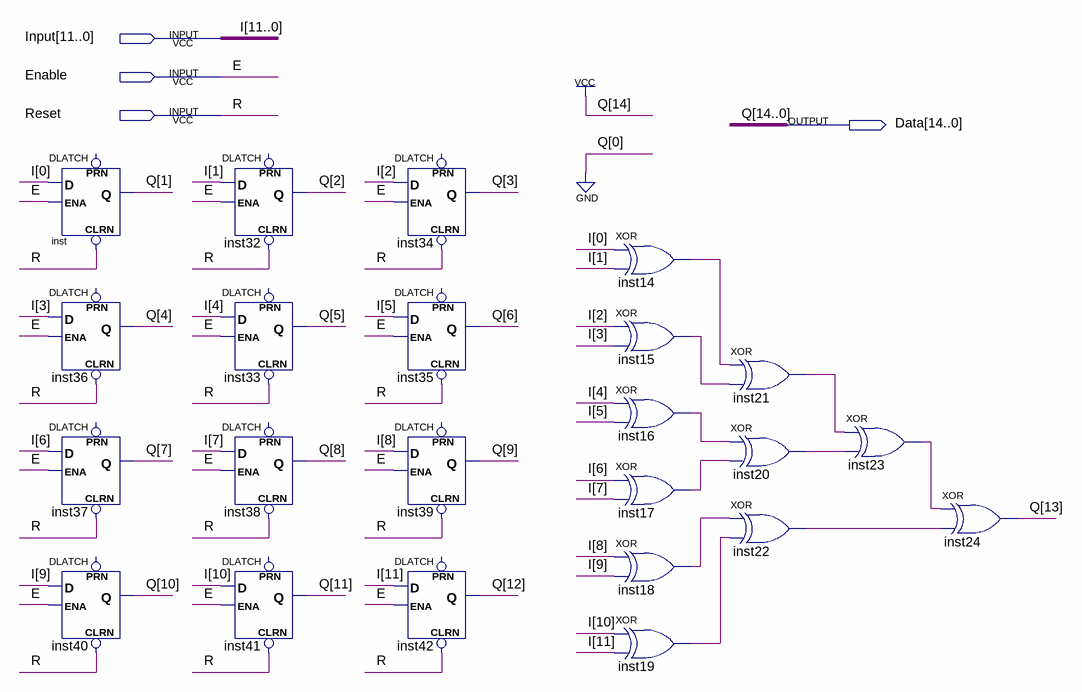
[diagram p0: schematic sheet]
// Quartus schematic data_loader.bdf as structural Verilog: 23 symbols, 4 pins
module data_loader (
  input  [11:0] Input,
  input  Enable,
  input  Reset,
  output [14:0] Data
);

  wire inst14_out, inst15_out, inst16_out, inst17_out, inst18_out, inst19_out, inst20_out, inst21_out,
       inst22_out, inst23_out;

  DLATCH inst (.CLRN(Reset), .D(Input[0]), .ENA(Enable), .Q(Data[1]));  // open: PRN
  DLATCH inst36 (.CLRN(Reset), .D(Input[3]), .ENA(Enable), .Q(Data[4]));  // open: PRN
  DLATCH inst37 (.CLRN(Reset), .D(Input[6]), .ENA(Enable), .Q(Data[7]));  // open: PRN
  DLATCH inst40 (.CLRN(Reset), .D(Input[9]), .ENA(Enable), .Q(Data[10]));  // open: PRN
  DLATCH inst32 (.CLRN(Reset), .D(Input[1]), .ENA(Enable), .Q(Data[2]));  // open: PRN
  DLATCH inst33 (.CLRN(Reset), .D(Input[4]), .ENA(Enable), .Q(Data[5]));  // open: PRN
  DLATCH inst38 (.CLRN(Reset), .D(Input[7]), .ENA(Enable), .Q(Data[8]));  // open: PRN
  DLATCH inst41 (.CLRN(Reset), .D(Input[10]), .ENA(Enable), .Q(Data[11]));  // open: PRN
  DLATCH inst34 (.CLRN(Reset), .D(Input[2]), .ENA(Enable), .Q(Data[3]));  // open: PRN
  DLATCH inst35 (.CLRN(Reset), .D(Input[5]), .ENA(Enable), .Q(Data[6]));  // open: PRN
  DLATCH inst39 (.CLRN(Reset), .D(Input[8]), .ENA(Enable), .Q(Data[9]));  // open: PRN
  DLATCH inst42 (.CLRN(Reset), .D(Input[11]), .ENA(Enable), .Q(Data[12]));  // open: PRN
  xor inst14 (inst14_out, Input[0], Input[1]);
  xor inst15 (inst15_out, Input[2], Input[3]);
  xor inst16 (inst16_out, Input[4], Input[5]);
  xor inst17 (inst17_out, Input[6], Input[7]);
  xor inst18 (inst18_out, Input[8], Input[9]);
  xor inst19 (inst19_out, Input[10], Input[11]);
  xor inst21 (inst21_out, inst14_out, inst15_out);
  xor inst20 (inst20_out, inst16_out, inst17_out);
  xor inst22 (inst22_out, inst18_out, inst19_out);
  xor inst23 (inst23_out, inst21_out, inst20_out);
  xor inst24 (Data[13], inst23_out, inst22_out);

  assign {Data[14], Data[0]} = 2'b10;

  // Other names for the same wires on the sheet: E = Enable; I[11:0] = Input; Q[13:1] = Data[13:1]; R = Reset
endmodule
